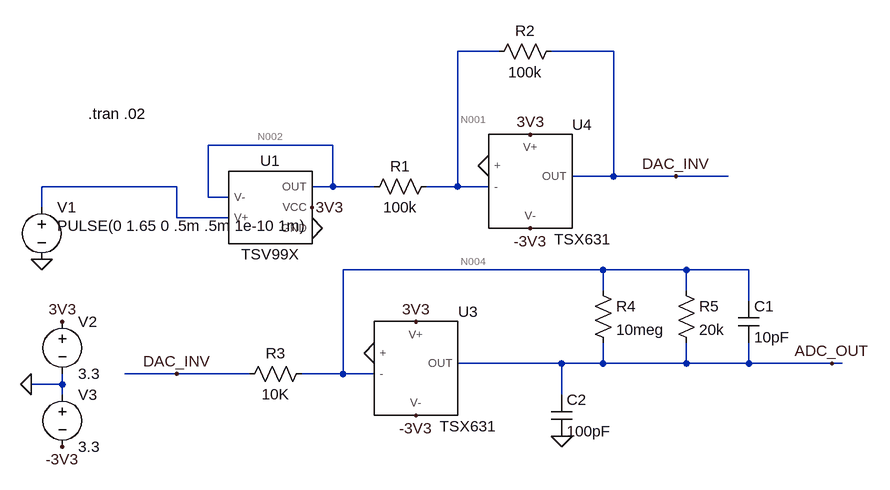
[diagram p0: schematic ALT0075 REV C.asc]
ALT0075 REV C.asc, the LTspice schematic file:
Version 4
SHEET 1 1236 680
WIRE 640 -112 576 -112
WIRE 816 -112 720 -112
WIRE 384 32 192 32
WIRE 816 80 816 -112
WIRE 816 80 752 80
WIRE 912 80 816 80
WIRE 992 80 912 80
WIRE 144 96 -64 96
WIRE 384 96 384 32
WIRE 384 96 352 96
WIRE 448 96 384 96
WIRE 576 96 576 -112
WIRE 576 96 528 96
WIRE 624 96 576 96
WIRE 192 112 192 32
WIRE 224 112 192 112
WIRE -64 128 -64 96
WIRE 144 144 144 96
WIRE 224 144 144 144
WIRE 800 224 400 224
WIRE 928 224 800 224
WIRE 1024 224 928 224
WIRE 800 256 800 224
WIRE 928 256 928 224
WIRE 1024 272 1024 224
WIRE 736 368 576 368
WIRE 800 368 800 336
WIRE 800 368 736 368
WIRE 928 368 928 336
WIRE 928 368 800 368
WIRE 1024 368 1024 336
WIRE 1024 368 928 368
WIRE 1152 368 1024 368
WIRE 1168 368 1152 368
WIRE 144 384 64 384
WIRE 256 384 144 384
WIRE 400 384 400 224
WIRE 400 384 336 384
WIRE 448 384 400 384
WIRE -32 400 -32 384
WIRE -32 400 -80 400
WIRE -32 416 -32 400
WIRE 736 416 736 368
FLAG -64 208 0
FLAG 352 160 0
FLAG -80 400 0
FLAG -32 304 3V3
FLAG -32 496 -3V3
FLAG 352 128 3V3
FLAG 688 16 3V3
FLAG 688 160 -3V3
FLAG 624 64 0
FLAG 912 80 DAC_INV
FLAG 144 384 DAC_INV
FLAG 512 304 3V3
FLAG 512 448 -3V3
FLAG 736 480 0
FLAG 1152 368 ADC_OUT
FLAG 448 352 0
SYMBOL AutoGenerated\\TSV99X 288 128 R0
SYMATTR InstName U1
SYMBOL voltage -64 112 R0
WINDOW 123 0 0 Left 2
WINDOW 39 0 0 Left 2
WINDOW 3 24 44 Left 2
SYMATTR Value PULSE(0 1.65 0 .5m .5m 1e-10 1m)
SYMATTR InstName V1
SYMBOL voltage -32 288 R0
WINDOW 123 0 0 Left 2
WINDOW 39 0 0 Left 2
SYMATTR InstName V2
SYMATTR Value 3.3
SYMBOL voltage -32 400 R0
WINDOW 123 0 0 Left 2
WINDOW 39 0 0 Left 2
SYMATTR InstName V3
SYMATTR Value 3.3
SYMBOL res 432 112 R270
WINDOW 0 32 56 VTop 2
WINDOW 3 0 56 VBottom 2
SYMATTR InstName R1
SYMATTR Value 100k
SYMBOL res 624 -96 R270
WINDOW 0 32 56 VTop 2
WINDOW 3 0 56 VBottom 2
SYMATTR InstName R2
SYMATTR Value 100k
SYMBOL AutoGenerated\\TSX631 512 368 R0
SYMATTR InstName U3
SYMBOL AutoGenerated\\TSX631 688 80 R0
SYMATTR InstName U4
SYMBOL res 240 400 R270
WINDOW 0 32 56 VTop 2
WINDOW 3 0 56 VBottom 2
SYMATTR InstName R3
SYMATTR Value 10K
SYMBOL res 784 240 R0
SYMATTR InstName R4
SYMATTR Value 10meg
SYMBOL res 912 240 R0
SYMATTR InstName R5
SYMATTR Value 20k
SYMBOL cap 1008 272 R0
SYMATTR InstName C1
SYMATTR Value 10pF
SYMBOL cap 720 416 R0
SYMATTR InstName C2
SYMATTR Value 100pF
TEXT 8 -16 Left 2 !.tran .02

The netlist it stands for:
* ALT0075 REV C.asc
XU1 N002 N003 N002 3V3 0 TSV99X  ; pins V- V+ OUT VCC GND
V1 N003 0 PULSE(0 1.65 0 .5m .5m 1e-10 1m)
V2 3V3 0 3.3
V3 0 -3V3 3.3
R1 N002 N001 100k
R2 N001 DAC_INV 100k
XU3 0 N004 3V3 -3V3 ADC_OUT TSX631  ; pins + - V+ V- OUT
XU4 0 N001 3V3 -3V3 DAC_INV TSX631  ; pins + - V+ V- OUT
R3 DAC_INV N004 10K
R4 N004 ADC_OUT 10meg
R5 N004 ADC_OUT 20k
C1 N004 ADC_OUT 10pF
C2 ADC_OUT 0 100pF
.tran .02
.lib D:\Github\LTSpice\LTS0000 - Models\TSX631.mod
.backanno
.end

* Results of the author's LTspice run, read from the files saved beside the schematic
* Operating Point, zero values left out:
*   V(n002) = 15.46 mV
*   V(3v3) = 3.3 V
*   V(-3v3) = -3.3 V
*   V(n001) = 2.312 µV
*   V(dac_inv) = -15.45 mV
*   V(n004) = -2.14 µV
*   V(adc_out) = 30.84 mV
*   I(R5) = -1.542 µA
*   I(R4) = -3.084 nA
*   I(R3) = -1.545 µA
*   I(R2) = 154.6 nA
*   I(R1) = 154.6 nA
*   I(V3) = -91.7 µA
*   I(V2) = -3.092 mA
*   I(V1) = 2.384 µA
*   Ix(u1:VM) = -1.819 µA
*   Ix(u1:VP) = -2.384 µA
*   Ix(u1:VS) = 1.665 µA
*   Ix(u1:VCCP) = 3 mA
*   Ix(u1:VCCN) = -2.997 mA
*   Ix(u3:VM) = -1 pA
*   Ix(u3:VCCP) = 46.55 µA
*   Ix(u3:VCCN) = -45 µA
*   Ix(u3:VS) = -1.545 µA
*   Ix(u4:VP) = -1 pA
*   Ix(u4:VCCP) = 45 µA
*   Ix(u4:VCCN) = -46.7 µA
*   Ix(u4:VS) = 1.7 µA
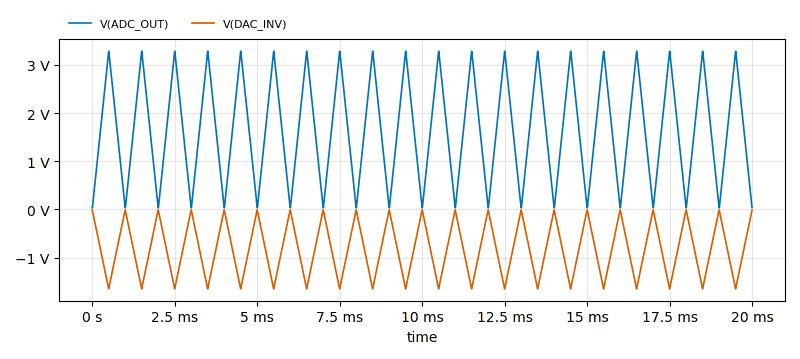
[diagram p1: Transient Analysis of ALT0075 REV C.asc, plotted from the saved traces]
* Transient Analysis, 1 run:
*   V(ADC_OUT): min 30.84 mV, max 3.281 V, average 1.647 V, rms 1.946 V, last 38.1 mV
*   V(DAC_INV): min -1.647 V, max -15.45 mV, average -825.1 mV, rms 975.1 mV, last -15.87 mV